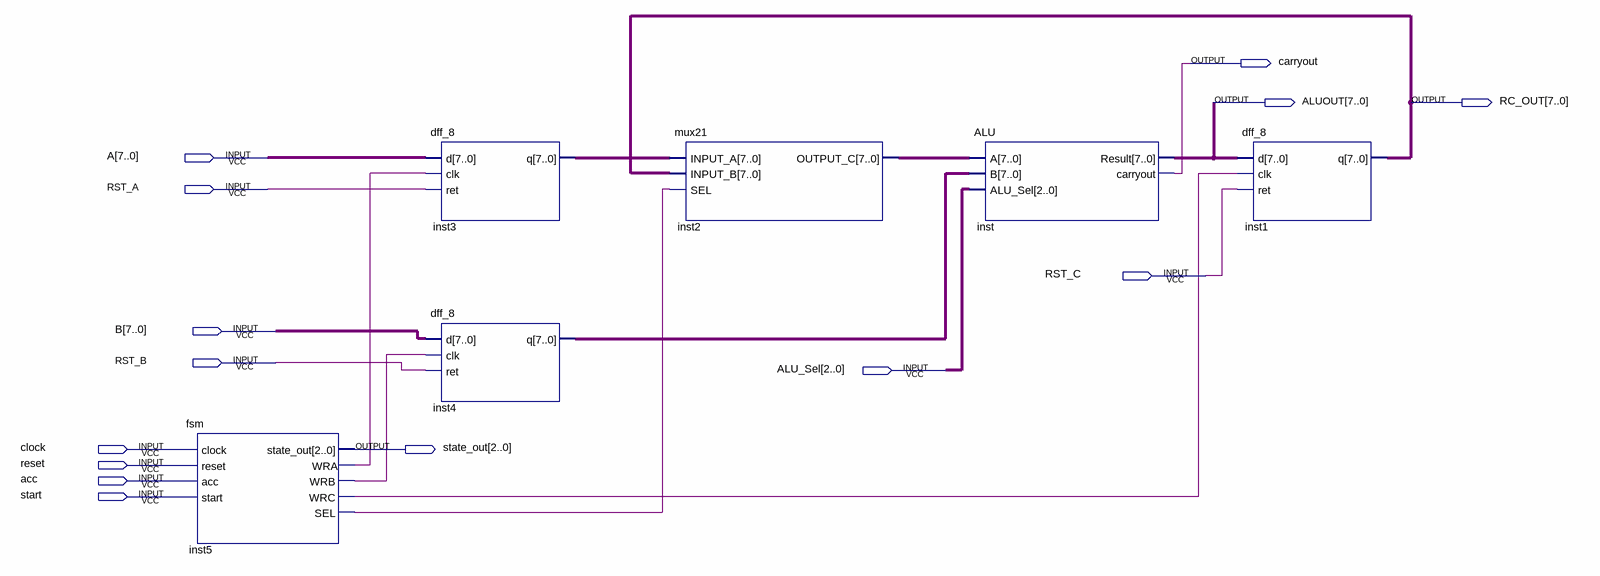
[diagram p0: schematic sheet]
// Quartus schematic Arithmetic-logic-unit-with-FSM.bdf as structural Verilog: 6 symbols, 14 pins
module \Arithmetic-logic-unit-with-FSM  (
  input  [7:0] A,
  input  RST_A,
  input  RST_C,
  input  [7:0] B,
  input  RST_B,
  input  [2:0] ALU_Sel,
  input  clock,
  input  reset,
  input  acc,
  input  start,
  output carryout,
  output [7:0] ALUOUT,
  output [7:0] RC_OUT,
  output [2:0] state_out
);

  wire inst5_sel, inst5_wra, inst5_wrb, inst5_wrc;
  wire [7:0] inst2_output_c, inst3_q, inst4_q;

  fsm inst5 (
    .clock(clock), .reset(reset), .acc(acc), .start(start), .state_out(state_out), .WRA(inst5_wra),
    .WRB(inst5_wrb), .WRC(inst5_wrc), .SEL(inst5_sel));
  dff_8 inst3 (.d(A), .clk(inst5_wra), .ret(RST_A), .q(inst3_q));
  dff_8 inst4 (.d(B), .clk(inst5_wrb), .ret(RST_B), .q(inst4_q));
  mux21 inst2 (.INPUT_A(inst3_q), .INPUT_B(RC_OUT), .SEL(inst5_sel), .OUTPUT_C(inst2_output_c));
  ALU inst (.A(inst2_output_c), .B(inst4_q), .ALU_Sel(ALU_Sel), .Result(ALUOUT), .carryout(carryout));
  dff_8 inst1 (.d(ALUOUT), .clk(inst5_wrc), .ret(RST_C), .q(RC_OUT));
endmodule
